# EAGLE design armTempSch (EAGLE 9.1.3)
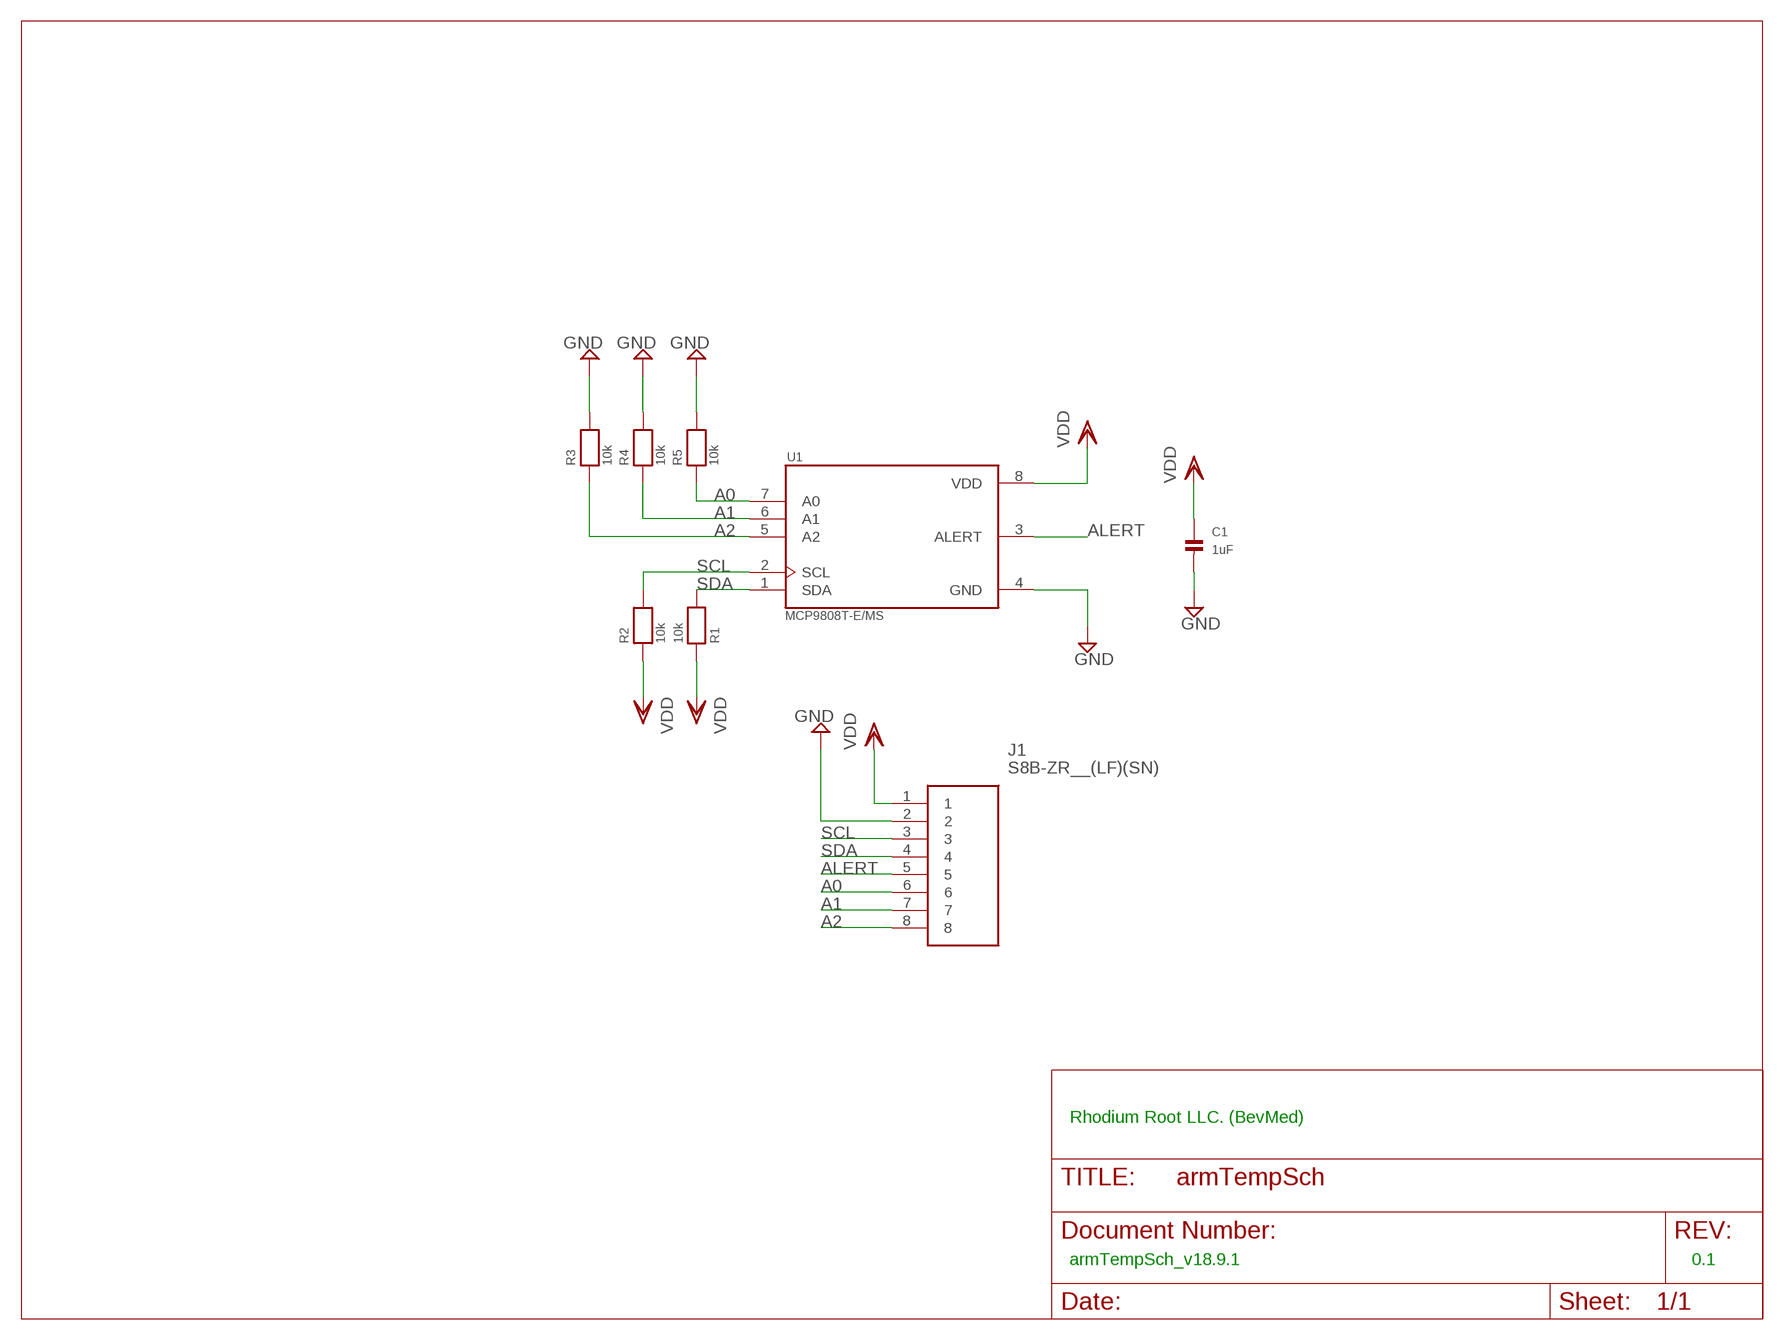
[diagram p0: schematic, sheet 1]

## Parts
C1  1uF  CAP_CERAMIC_0805  [_0805]
J1  S8B-ZR__(LF)(SN)  [SHDR8W50P0X150_1X8_1350X600X37]
R1  10k  RESISTOR0805  [0805]
R2  10k  RESISTOR0805  [0805]
R3  10k  RESISTOR0805  [0805]
R4  10k  RESISTOR0805  [0805]
R5  10k  RESISTOR0805  [0805]
U1  MCP9808T-E/MS  [SOP65P490X110-8N]

## Nets
A0: J1.6 R5.1 U1.7(A0)
A1: J1.7 R4.1 U1.6(A1)
A2: J1.8 R3.1 U1.5(A2)
ALERT: J1.5 U1.3(ALERT)
GND: C1.2 J1.2 R3.2 R4.2 R5.2 U1.4(GND)
SCL: J1.3 R2.2 U1.2(SCL)
SDA: J1.4 R1.2 U1.1(SDA)
VDD: C1.1 J1.1 R1.1 R2.1 U1.8(VDD)

## Notes on the sheet
- Rhodium Root LLC. (BevMed)
- armTempSch_v18.9.1 | 0.1

## Library data of the parts
C1 = microbuilder:CAP_CERAMIC: Ceramic Capacitors 0402 - 0402 Surface Mount Capacitors 16pF 50V 5% [Digikey: 445-4899-2-ND] 18pF 50V 5% [Digikey: 490-1281-2-ND] 22pF 50V 5% [Digikey: 490-1283-2-ND] 68pF 50V 5% [Digikey: 490-1289-2-ND] 0.1uF 10V 10% [Digikey: 490-1318-2-ND] 1.0uF 6.3V 10% [Digikey: 490-1320-2-ND] 0603 - 0603 Surface Mount Capacitors 16 pF 50V 5% [Digikey: 445-5051-2-ND] 22 pF 50V [Digikey: PCC220ACVTR-ND] 33 pF 50V 5% [Digikey: 490-1415-1-ND] 56pF 50V 5% [Digikey: 490-1421-1-ND] 220pF 50V 5% [Digikey: 445-1285-1-ND] 680 pF 50V 2200 pF 50V 5% C0G [Digikey: 445-1297-1-ND] 5600 pF 100V 5% X7R [Digikey: 478-3711-1-ND] 0.1 µF 25V 10% [Digikey: PCC2277TR-ND] 0.22 µF 16V 10% X7R [Digikey: 445-1318-1-ND] 1.0 µF 25V 10% [Digikey: 445-5146-2-ND] 0603 - RF Specific 3pF 250V +/-0.1pF RF [Digikey: 712-1347-1-ND] 18 pF 250V 5% [Digikey: 478-3505-1-ND or 712-1322-1-ND] 56 pF 250V 5% C0G RF [Digikey: 490-4867-1-ND] 68 pF 250V RF [Digikey: 490-4868-1-ND] 0805 - 0805 Surface Mount Capacitors 220 pF 250V 2% RF Ceramic Capacitor [Digikey: 712-1398-1-ND] 1000 pF 50V 2% NP0 Ceramic Capacitor [Digikey: 478-3760-1-ND] 0.1 µF 25V 10% Ceramic Capacitor [Digikey: PCC1828TR-ND] 1.0 µF 16V 10% Ceramic Capacitor[Digikey: 490-1691-2-ND] 10.0 µF 10V 10% Ceramic Capacitor[Digikey: 709-1228-1-ND] 10.0 uF 16V 10% Ceramic Capacitor [Digikey: 478-5165-2-ND] 47 uF 6.3V 20% Ceramic Capacitor [Digikey: 587-1779-1-ND or 399-5506-1-ND] 1206 - 1206 Surface Mount Capacitors 47uF 10V 20% Ceramic Capacitor [Digikey: 490-5528-1-ND or 399-5508-1-ND or 445-6010-1-ND] 100uF 6.3V -20%, +80% Y5V Ceramic Capacitor (Digikey: 490-4512-1-ND, Mouser: 81-GRM31CF50J107ZE1L); MPN: MCTT21X105K160CT; OC_NEWARK: 06R3671
J1 = S8B-ZR__(LF)(SN):S8B-ZR__(LF)(SN): JST ZH Series, 1.5mm Pitch 8 Way 1 Row Side Entry PCB Header, Solder Termination, 1A Source: Datasheet <http://www.jst.co.uk/downloads/series/eZH_(11-10-30).pdf>; ARROW_PART_NUMBER: S8B-ZR (LF)(SN); ARROW_PRICE-STOCK: http://uk.rs-online.com/web/p/products/1724983; DESCRIPTION: JST ZH Series, 1.5mm Pitch 8 Way 1 Row Side Entry PCB Header, Solder Termination, 1A; HEIGHT: 3.7mm; MANUFACTURER_NAME: JST (JAPAN SOLDERLESS TERMINALS); MANUFACTURER_PART_NUMBER: S8B-ZR (LF)(SN); MPN: S8B-ZR; OC_NEWARK: 90R9352; RS_PART_NUMBER: 1724983; RS_PRICE-STOCK: http://uk.rs-online.com/web/p/products/1724983
R1-R5 = microbuilder:RESISTOR: Resistors 0402 - 0402 Surface Mount Package 22 Ohm 1% 1/16W [Digikey: 311-22.0LRTR-ND] 33 Ohm 5% 1/16W 1.0K 5% 1/16W 1.5K 5% 1/16W 2.0K 1% 1/16W 10.0K 1% 1/16W [Digikey: 311-10.0KLRTR-ND] 10.0K 5% 1/16W [Digikey: RMCF0402JT10K0TR-ND] 12.1K 1% 1/16W [Digikey: 311-22.0LRTR-ND] 100.0K 5% 1/16W 0603 - 0603 Surface Mount Package 0 Ohm 1/10 Watt 1% Resistor 15 Ohm 1/10 Watt 1% Resistor 33 Ohm 1/10 Watt 1% Resistor 49.9 Ohm 1/10 Watt 1% Resistor 100 Ohm 1/10 Watt 1% Resistor 150 Ohm 1/10 Watt 1% Resistor 240 Ohm 1/10 Watt 1% Resistor 390 Ohm 1/10 Watt 1% Resistor 560 Ohm 1/10 Watt 1% Resistor 680 Ohm 1/10 Watt 1% Resistor 750 Ohm 1/10 Watt 1% Resistor 1.0K Ohm 1/10 Watt 1% Resistor 1.5K Ohm 1/10 Watt 1% Resistor 2.0K Ohm 1/10 Watt 1% Resistor 2.2K Ohm 1/10 Watt 1% Resistor 3.3K Ohm 1/10 Watt 1% Resistor 4.7K Ohm 1/10 Watt 1% Resistor 10.0K Ohm 1/10 Watt 1% Resistor 12.0K Ohm 1/10 Watt 1% Resistor 12.1K Ohm 1/10 Watt 1% Resistor 20.0K Ohm 1/10 Watt 1% Resistor 33.0K Ohm 1/10 Watt 1% Resistor 100.0K Ohm 1/10 Watt 1% Resistor 0805 - 0805 Surface Mount Package 0 Ohm 1/8 Watt 1% Resistor 33 Ohm 1/8 Watt 1% Resistor 100 Ohm 1/8 Watt 1% Resistor 150 Ohm 1/8 Watt 1% Resistor 200 Ohm 1/8 Watt 1% Resistor 240 Ohm 1/8 Watt 1% Resistor 330 Ohm 1/8 Watt 1% Resistor 390 Ohm 1/8 Watt 1% Resistor 470 Ohm 1/8 Watt 1% Resistor 1.0K Ohm 1/8 Watt 1% Resistor 1.5K Ohm 1/8 Watt 1% Resistor 2.0K Ohm 1/8 Watt 1% Resistor 4.7K Ohm 1/8 Watt 1% Resistor 5.1K Ohm 1/8 Watt 1% Resistor 5.6K Ohm 1/8 Watt 1% Resistor 10.0K Ohm 1/8 Watt 1% Resistor 22.0K Ohm 1/8 Watt 1% Resistor 33.0K Ohm 1/8 Watt 1% Resistor 100K Ohm 1/8 Watt 1% Resistor 1206 - 1206 Surface Mount Package 2012 - 2010 Surface Mount Package 0.11 Ohm 1/2 Watt 1% Resistor - Digikey: RHM.11UCT-ND; MPN: ERJ-6GEYJ103V; OC_NEWARK: 67T1248
U1 = MCP9808T-E_MS:MCP9808T-E/MS: Board Mount Temperature Sensors Silicon temp sensor with I2C interface; DESCRIPTION: MCP9808 Series 3.6 V Memory Module Digital Temperature Sensor SMT - MSOP-8; MF: Microchip; MP: MCP9808T-E/MS; MPN: MCP9808T-E/MS; OC_NEWARK: 55AC2747; PACKAGE: MSOP-8 Microchip

## Board
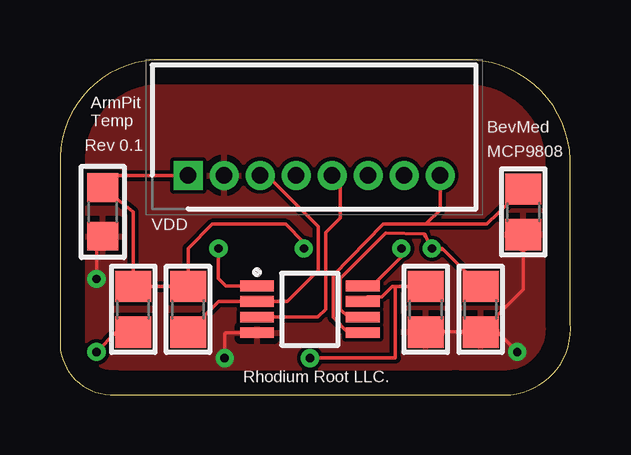
[diagram p1: board, top side]
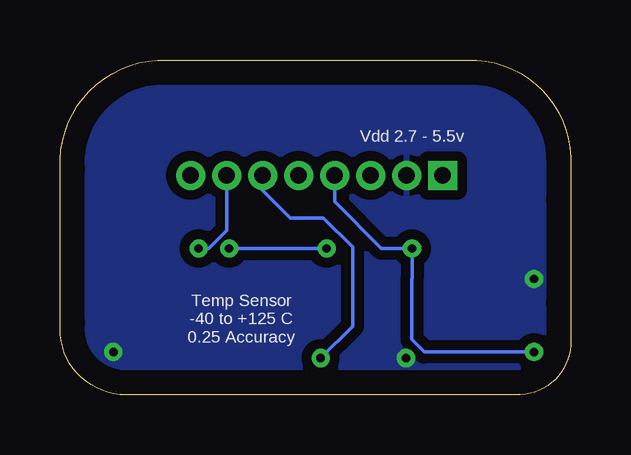
[diagram p2: board, bottom side, seen from below]

Size 21.27 x 13.96 mm. Coordinates in mm from the lower left corner, seen from the top.
Outline: 0,8.14 0,9.92 arc-90 4.3,13.96 17.21,13.96 arc-90 21.26,9.4 21.26,2.99 arc-90 18.77,0 16.49,0 2.29,0 arc-90 0,2.05
Outline: 0,8.14 0,3.83
Outline: 0,8.14 0,2.05
Outline: 0,2.05 0,2.05
Copper layers (1*16): Top 0.035mm / dielectric 1.5mm / Bottom 0.035mm
Design rules "default": minimum track width 6mil, minimum drill 0.35mm, track to track 6mil, track to pad 6mil, pad to pad 6mil, via to via 6mil, smd to smd 6mil, copper to edge 40mil, drill to drill 6mil, minimum pad ring 10mil, minimum via ring 8mil, stop-mask expansion 4mil, vias tented up to drill 0mil, thermal gap 10mil

### Footprints (pad centres in the part's own frame; a part is rotated, then mirrored left to right if it is on the bottom)
_0805 = smd 1.2 x 1.3: 1 -1.016,0; 2 1.016,0
SHDR8W50P0X150_1X8_1350X600X37 = drill 0.7 pad 1.1 square: 1 0,0 | drill 0.7 pad 1.1: 2 1.5,0; 3 3,0; 4 4.5,0; 5 6,0; 6 7.5,0; 7 9,0; 8 10.5,0
0805 = smd 1.3 x 1.5: 1 -0.95,0; 2 0.95,0
SOP65P490X110-8N = smd 1.4 x 0.45: 1 -2.2,0.975; 2 -2.2,0.325; 3 -2.2,-0.325; 4 -2.2,-0.975; 5 2.2,-0.975; 6 2.2,-0.325; 7 2.2,0.325; 8 2.2,0.975

### Placement (x,y rotation side)
C1  1.78,7.62 270 top
J1  5.33,9.15 0 top
R1  3.05,3.56 270 top
R2  5.33,3.56 270 top
R3  19.3,7.62 270 top
R4  17.53,3.56 270 top
R5  15.24,3.56 270 top
U1  10.41,3.56 0 top

### Tracks (layer width: path | path; a pad name or v marks a point on that pad's centre or on a via)
A0  (via drill 0.35)
  Top 0.152: U1.7 12.81,4.08 13.41,4.08 13.84,4.51 13.97,4.51 | R5.1 14.22,4.51 13.97,4.51 | 13.97,4.51 13.97,1.53 v10.41,1.53
  Bottom 0.152: v10.41,1.53 9.08,2.86 9.08,6.16 10.29,7.37 11.68,7.37 12.95,8.64 12.95,9.03 J1.6
A1  (via drill 0.35)
  Top 0.152: U1.6 12.01,3.23 11.68,3.56 11.68,4.85 13.58,6.74 15.17,6.7 15.23,6.6 v15.49,6.1 | R4.1 16.22,5.81 | 16.22,5.81 15.97,6.06 15.53,6.06 v15.49,6.1 | v15.49,6.1 15.94,6.1 16.22,5.81
  Bottom 0.152: v15.49,6.1 15.08,6.1 14.33,6.85 J1.7
A2
  Top 0.152: U1.5 12.02,2.58 11.38,3.22 11.38,4.98 13.46,7.11 15.24,7.11 | J1.8 15.83,7.71 15.24,7.11 | R3.1 17.78,7.11 15.24,7.11
ALERT
  Top 0.152: U1.3 10.75,3.23 11.07,3.56 11.07,6.76 11.68,7.37 11.68,8.8 J1.5
GND  (via drill 0.35)
  Top 0.152: U1.4 6.9,2.58 6.86,2.54 v6.86,1.53 | v1.52,4.83 1.52,6.35 C1.2 | R3.2 19.3,4.39 R4.2 R5.2 18.22,2.61 v19.05,1.78
  pour Bottom (isolate 0.406): 0,0 0,13.97 21.08,13.97 21.08,0
  pour Top: 0,13.97 0,0 21.08,0 21.08,13.97
SCL
  Top 0.152: R2.2 6.61,3.88 U1.2 9.47,3.88 10.77,5.18 10.77,7.01 8.64,9.15 J1.3
SDA  (via drill 0.35)
  Top 0.152: v1.52,1.78 2.35,2.61 R1.2 | U1.1 6.91,4.53 6.6,4.84 v6.6,6.1
  Bottom 0.152: v1.52,1.78 6.1,1.78 6.61,2.3 6.61,4.83 6.6,4.84 v6.6,6.1 7.89,6.1 9.83,8.05 J1.4
VDD  (via drill 0.35)
  Top 0.152: J1.1 2.03,9.15 1.78,8.89 C1.1 3.05,7.62 R1.1 R2.1 | R2.1 5.33,4.83 R2.1 | U1.8 13.01,4.53 14.22,5.74 v14.22,6.1 | R2.1 5.33,6.1 6.35,7.11 9.4,7.11 10.16,6.35 v10.16,6.1
  Bottom 0.152: v14.22,6.1 v10.16,6.1

### Text on the board
tPlace: ArmPit / Temp | BevMed | Rev 0.1 | MCP9808 | VDD | Rhodium Root LLC.
bPlace: Vdd 2.7 - 5.5v | Temp Sensor / -40 to +125 C / 0.25 Accuracy